# Altium schematic sheet 2 - Peripherals.SchDoc
size Tabloid
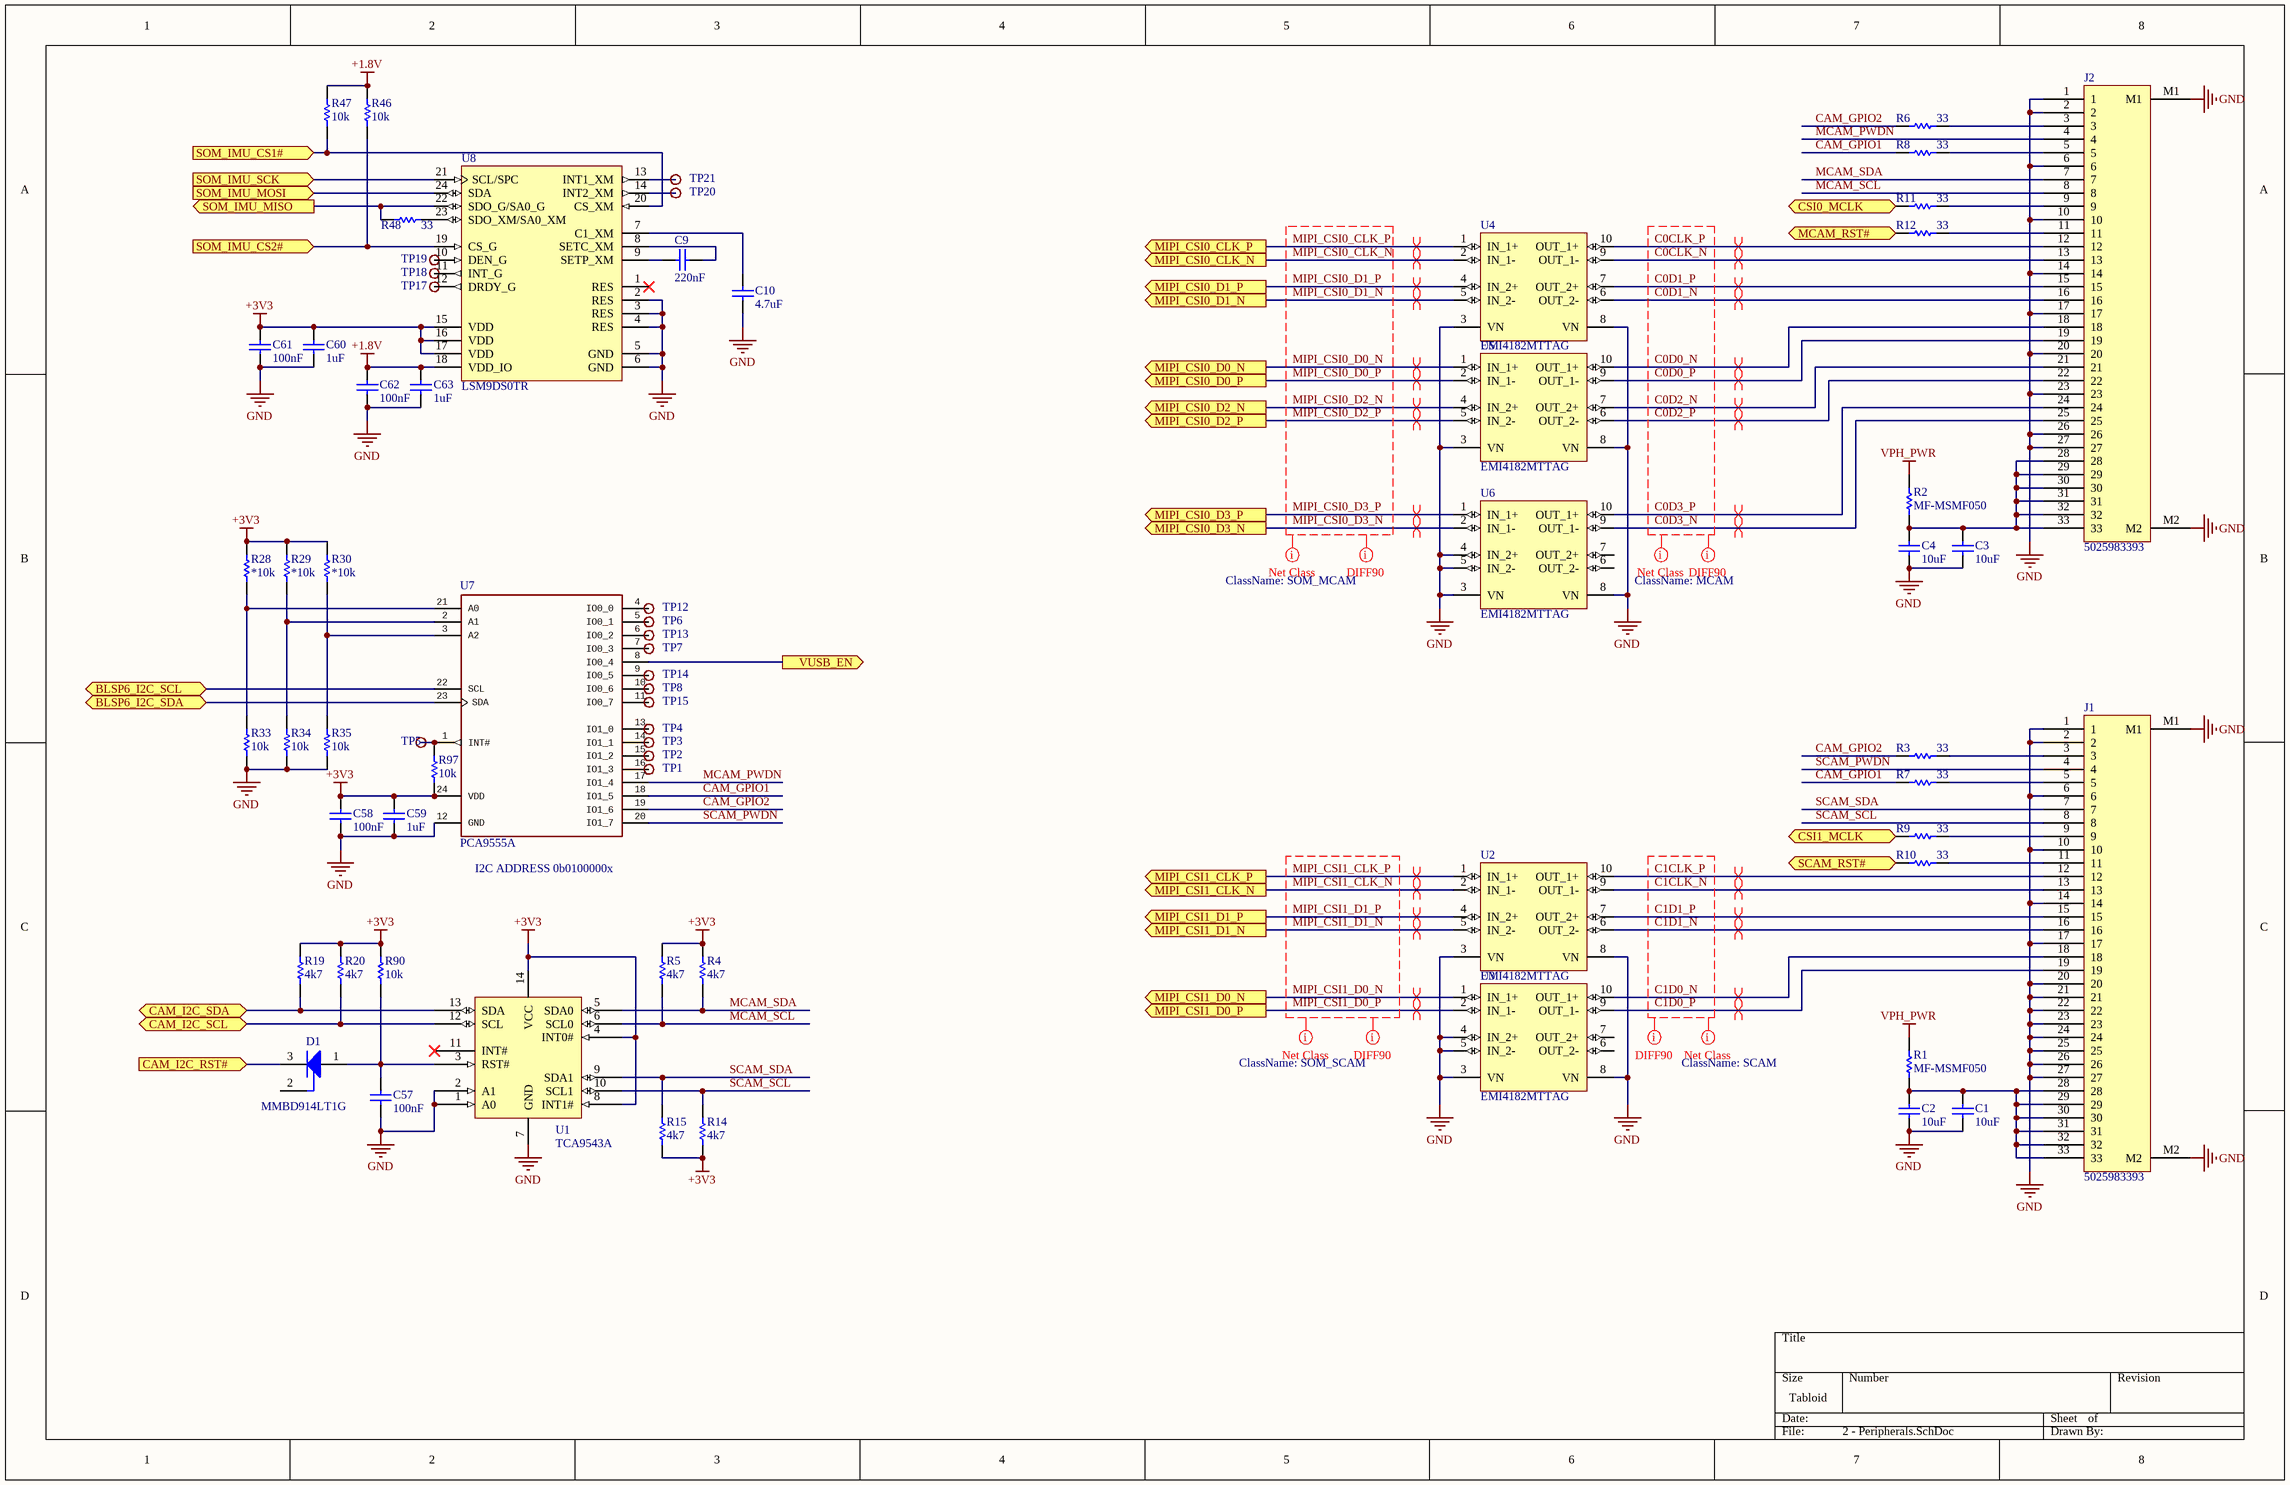
[diagram p0: 2 - Peripherals.SchDoc]

## Parts
C1  value 10uF  [CAPC0805(2012)100_L]  (hidden comment: CAP 10uF 6.3V 0805(2012))
C2  value 10uF  [CAPC0805(2012)100_L]  (hidden comment: CAP 10uF 6.3V 0805(2012))
C3  value 10uF  [CAPC0805(2012)100_L]  (hidden comment: CAP 10uF 6.3V 0805(2012))
C4  value 10uF  [CAPC0805(2012)100_L]  (hidden comment: CAP 10uF 6.3V 0805(2012))
C9  value 220nF  [CAPC0805(2012)100_L]
C10  value 4.7uF  [CAPC0805(2012)100_L]  (hidden comment: CAP 4.7uF 6.3V 0805(2012))
C57  value 100nF  [CAPC0805(2012)100_L]  (hidden comment: CAP 100nF 6.3V 0805(2012))
C58  value 100nF  [CAPC0805(2012)100_L]  (hidden comment: CAP 100nF 6.3V 0805(2012))
C59  value 1uF  [CAPC0805(2012)100_L]  (hidden comment: CAP 1uF 6.3V 0805(2012))
C60  value 1uF  [CAPC0805(2012)100_L]  (hidden comment: CAP 1uF 6.3V 0805(2012))
C61  value 100nF  [CAPC0805(2012)100_L]  (hidden comment: CAP 100nF 6.3V 0805(2012))
C62  value 100nF  [CAPC0805(2012)100_L]  (hidden comment: CAP 100nF 6.3V 0805(2012))
C63  value 1uF  [CAPC0805(2012)100_L]  (hidden comment: CAP 1uF 6.3V 0805(2012))
D1  MMBD914LT1G  [ONSC-SOT-23-3-318-08_V]
J1  5025983393  [J_MOLEX_50259833]
J2  5025983393  [J_MOLEX_50259833]
R1  MF-MSMF050  [BOUR-MF-MSMF050-2_V]
R2  MF-MSMF050  [BOUR-MF-MSMF050-2_V]
R3  value 33  [RESC0805(2012)_L]  (hidden comment: 33R 1% 0805(2012))
R4  value 4k7  [RESC0805(2012)_L]  (hidden comment: 4K7 1% 0805(2012))
R5  value 4k7  [RESC0805(2012)_L]  (hidden comment: 4K7 1% 0805(2012))
R6  value 33  [RESC0805(2012)_L]  (hidden comment: 33R 1% 0805(2012))
R7  value 33  [RESC0805(2012)_L]  (hidden comment: 33R 1% 0805(2012))
R8  value 33  [RESC0805(2012)_L]  (hidden comment: 33R 1% 0805(2012))
R9  value 33  [RESC0805(2012)_L]  (hidden comment: 33R 1% 0805(2012))
R10  value 33  [RESC0805(2012)_L]  (hidden comment: 33R 1% 0805(2012))
R11  value 33  [RESC0805(2012)_L]  (hidden comment: 33R 1% 0805(2012))
R12  value 33  [RESC0805(2012)_L]  (hidden comment: 33R 1% 0805(2012))
R14  value 4k7  [RESC0805(2012)_L]  (hidden comment: 4K7 1% 0805(2012))
R15  value 4k7  [RESC0805(2012)_L]  (hidden comment: 4K7 1% 0805(2012))
R19  value 4k7  [RESC0805(2012)_L]  (hidden comment: 4K7 1% 0805(2012))
R20  value 4k7  [RESC0805(2012)_L]  (hidden comment: 4K7 1% 0805(2012))
R28  value *10k  [RESC0805(2012)_L]  (hidden comment: 100k)
R29  value *10k  [RESC0805(2012)_L]  (hidden comment: 100k)
R30  value *10k  [RESC0805(2012)_L]  (hidden comment: 100k)
R33  value 10k  [RESC0805(2012)_L]  (hidden comment: 100k)
R34  value 10k  [RESC0805(2012)_L]  (hidden comment: 100k)
R35  value 10k  [RESC0805(2012)_L]  (hidden comment: 100k)
R46  value 10k  [RESC0805(2012)_L]  (hidden comment: 10K 1% 0805(2012))
R47  value 10k  [RESC0805(2012)_L]  (hidden comment: 10K 1% 0805(2012))
R48  value 33  [RESC0805(2012)_L]  (hidden comment: 33R 1% 0805(2012))
R90  value 10k  [RESC0805(2012)_L]  (hidden comment: 100k)
R97  10k  [RESC0805(2012)_L]
TP1  Various test points  [VIAHOLE20]  (value not drawn)
TP2  Various test points  [VIAHOLE20]  (value not drawn)
TP3  Various test points  [VIAHOLE20]  (value not drawn)
TP4  Various test points  [VIAHOLE20]  (value not drawn)
TP5  Various test points  [VIAHOLE20]  (value not drawn)
TP6  Various test points  [VIAHOLE20]  (value not drawn)
TP7  Various test points  [VIAHOLE20]  (value not drawn)
TP8  Various test points  [VIAHOLE20]  (value not drawn)
TP12  Various test points  [VIAHOLE20]  (value not drawn)
TP13  Various test points  [VIAHOLE20]  (value not drawn)
TP14  Various test points  [VIAHOLE20]  (value not drawn)
TP15  Various test points  [VIAHOLE20]  (value not drawn)
TP17  Various test points  [VIAHOLE20]  (value not drawn)
TP18  Various test points  [VIAHOLE20]  (value not drawn)
TP19  Various test points  [VIAHOLE20]  (value not drawn)
TP20  Various test points  [VIAHOLE20]  (value not drawn)
TP21  Various test points  [VIAHOLE20]  (value not drawn)
U1  TCA9543A  [SO14]
U2  EMI4182MTTAG  [ONSC-WDFN-10-511BM-01_V]
U3  EMI4182MTTAG  [ONSC-WDFN-10-511BM-01_V]
U4  EMI4182MTTAG  [ONSC-WDFN-10-511BM-01_V]
U5  EMI4182MTTAG  [ONSC-WDFN-10-511BM-01_V]
U6  EMI4182MTTAG  [ONSC-WDFN-10-511BM-01_V]
U7  PCA9555A  [SSOP24]
U8  LSM9DS0TR  [STM-LGA-24_V]

## Ports
BLSP6_I2C_SCL (bidir), BLSP6_I2C_SDA (bidir), CAM_I2C_RST# (in), CAM_I2C_SCL (bidir), CAM_I2C_SDA (bidir), CSI0_MCLK (in), CSI1_MCLK (in), MCAM_RST# (in), MIPI_CSI0_CLK_N (out), MIPI_CSI0_CLK_P (out), MIPI_CSI0_D0_N (out), MIPI_CSI0_D0_P (out), MIPI_CSI0_D1_N (out), MIPI_CSI0_D1_P (out), MIPI_CSI0_D2_N (out), MIPI_CSI0_D2_P (out), MIPI_CSI0_D3_N (out), MIPI_CSI0_D3_P (out), MIPI_CSI1_CLK_N (out), MIPI_CSI1_CLK_P (out), MIPI_CSI1_D0_N (out), MIPI_CSI1_D0_P (out), MIPI_CSI1_D1_N (out), MIPI_CSI1_D1_P (out), SCAM_RST# (in), SOM_IMU_CS1# (in), SOM_IMU_CS2# (in), SOM_IMU_MISO (out), SOM_IMU_MOSI (in), SOM_IMU_SCK (in), VUSB_EN (out)

## Nets
+1.8V: C62.1 C63.1 R46.1 R47.1 U8.18(VDD_IO)
+3V3: C58.1 C59.1 C60.1 C61.1 R4.2 R5.2 R14.1 R15.1 R19.2 R20.2 R28.2 R29.2 R30.2 R90.2 R97.1 U1.4(INT0#) U1.8(INT1#) U1.14(VCC) U7.24(VDD) U8.15(VDD) U8.16(VDD) U8.17(VDD)
GND: C1.1 C2.1 C3.1 C4.1 C10.1 C57.2 C58.2 C59.2 C60.2 C61.2 C62.2 C63.2 J1.1 J1.2 J1.6 J1.10 J1.14 J1.17 J1.20 J1.21 J1.22 J1.23 J1.24 J1.25 J1.26 J1.27 J1.M1 J1.M2 J2.1 J2.2 J2.6 J2.10 J2.14 J2.17 J2.20 J2.23 J2.26 J2.27 J2.M1 J2.M2 R33.1 R34.1 R35.1 U1.1(A0) U1.2(A1) U1.7(GND) U2.3(VN) U2.8(VN) U3.3(VN) U3.4(IN_2+) U3.5(IN_2-) U3.8(VN) U4.3(VN) U4.8(VN) U5.3(VN) U5.8(VN) U6.3(VN) U6.4(IN_2+) U6.5(IN_2-) U6.8(VN) U7.12(GND) U8.2(RES) U8.3(RES) U8.4(RES) U8.5(GND) U8.6(GND)
VPH_PWR: R1.2 R2.2
BLSP6_I2C_SCL: U7.22(SCL) ; port BLSP6_I2C_SCL
BLSP6_I2C_SDA: U7.23(SDA) ; port BLSP6_I2C_SDA
C0CLK_N: J2.13 U4.9(OUT_1-)
C0CLK_P: J2.12 U4.10(OUT_1+)
C0D0_N: J2.18 U5.10(OUT_1+)
C0D0_P: J2.19 U5.9(OUT_1-)
C0D1_N: J2.16 U4.6(OUT_2-)
C0D1_P: J2.15 U4.7(OUT_2+)
C0D2_N: J2.21 U5.7(OUT_2+)
C0D2_P: J2.22 U5.6(OUT_2-)
C0D3_N: J2.25 U6.9(OUT_1-)
C0D3_P: J2.24 U6.10(OUT_1+)
C1CLK_N: J1.13 U2.9(OUT_1-)
C1CLK_P: J1.12 U2.10(OUT_1+)
C1D0_N: J1.18 U3.10(OUT_1+)
C1D0_P: J1.19 U3.9(OUT_1-)
C1D1_N: J1.16 U2.6(OUT_2-)
C1D1_P: J1.15 U2.7(OUT_2+)
CAM_GPIO1: R7.1 R8.1 U7.18(IO1_5)
CAM_GPIO2: R3.1 R6.1 U7.19(IO1_6)
CAM_I2C_RST#: D1.3(K) ; port CAM_I2C_RST#
CAM_I2C_SCL: R20.1 U1.12(SCL) ; port CAM_I2C_SCL
CAM_I2C_SDA: R19.1 U1.13(SDA) ; port CAM_I2C_SDA
CSI0_MCLK: R11.1 ; port CSI0_MCLK
CSI1_MCLK: R9.1 ; port CSI1_MCLK
MCAM_PWDN: J2.4 U7.17(IO1_4)
MCAM_RST#: R12.1 ; port MCAM_RST#
MCAM_SCL: J2.8 R5.1 U1.6(SCL0)
MCAM_SDA: J2.7 R4.1 U1.5(SDA0)
MIPI_CSI0_CLK_N: U4.2(IN_1-) ; port MIPI_CSI0_CLK_N
MIPI_CSI0_CLK_P: U4.1(IN_1+) ; port MIPI_CSI0_CLK_P
MIPI_CSI0_D0_N: U5.1(IN_1+) ; port MIPI_CSI0_D0_N
MIPI_CSI0_D0_P: U5.2(IN_1-) ; port MIPI_CSI0_D0_P
MIPI_CSI0_D1_N: U4.5(IN_2-) ; port MIPI_CSI0_D1_N
MIPI_CSI0_D1_P: U4.4(IN_2+) ; port MIPI_CSI0_D1_P
MIPI_CSI0_D2_N: U5.4(IN_2+) ; port MIPI_CSI0_D2_N
MIPI_CSI0_D2_P: U5.5(IN_2-) ; port MIPI_CSI0_D2_P
MIPI_CSI0_D3_N: U6.2(IN_1-) ; port MIPI_CSI0_D3_N
MIPI_CSI0_D3_P: U6.1(IN_1+) ; port MIPI_CSI0_D3_P
MIPI_CSI1_CLK_N: U2.2(IN_1-) ; port MIPI_CSI1_CLK_N
MIPI_CSI1_CLK_P: U2.1(IN_1+) ; port MIPI_CSI1_CLK_P
MIPI_CSI1_D0_N: U3.1(IN_1+) ; port MIPI_CSI1_D0_N
MIPI_CSI1_D0_P: U3.2(IN_1-) ; port MIPI_CSI1_D0_P
MIPI_CSI1_D1_N: U2.5(IN_2-) ; port MIPI_CSI1_D1_N
MIPI_CSI1_D1_P: U2.4(IN_2+) ; port MIPI_CSI1_D1_P
SCAM_PWDN: J1.4 U7.20(IO1_7)
SCAM_RST#: R10.1 ; port SCAM_RST#
SCAM_SCL: J1.8 R14.2 U1.10(SCL1)
SCAM_SDA: J1.7 R15.2 U1.9(SDA1)
SOM_IMU_CS1#: R47.2 U8.20(CS_XM) ; port SOM_IMU_CS1#
SOM_IMU_CS2#: R46.2 U8.19(CS_G) ; port SOM_IMU_CS2#
SOM_IMU_MISO: R48.1 U8.22(SDO_G/SA0_G) ; port SOM_IMU_MISO
SOM_IMU_MOSI: U8.24(SDA) ; port SOM_IMU_MOSI
SOM_IMU_SCK: U8.21(SCL/SPC) ; port SOM_IMU_SCK
VUSB_EN: U7.8(IO0_4) ; port VUSB_EN
NetC1_2: C1.2 C2.2 J1.28 J1.29 J1.30 J1.31 J1.32 J1.33 R1.1
NetC3_2: C3.2 C4.2 J2.28 J2.29 J2.30 J2.31 J2.32 J2.33 R2.1
NetC9_1: C9.1 U8.9(SETP_XM)
NetC9_2: C9.2 U8.8(SETC_XM)
NetC10_2: C10.2 U8.7(C1_XM)
NetC57_1: C57.1 D1.1(A) R90.1 U1.3(RST#)
NetJ1_3: J1.3 R3.2
NetJ1_5: J1.5 R7.2
NetJ1_9: J1.9 R9.2
NetJ1_11: J1.11 R10.2
NetJ2_3: J2.3 R6.2
NetJ2_5: J2.5 R8.2
NetJ2_9: J2.9 R11.2
NetJ2_11: J2.11 R12.2
NetR28_1: R28.1 R33.2 U7.21(A0)
NetR29_1: R29.1 R34.2 U7.2(A1)
NetR30_1: R30.1 R35.2 U7.3(A2)
NetR48_2: R48.2 U8.23(SDO_XM/SA0_XM)
NetR97_2: R97.2 TP5.1 U7.1(INT#)
NetTP1_1: TP1.1 U7.16(IO1_3)
NetTP2_1: TP2.1 U7.15(IO1_2)
NetTP3_1: TP3.1 U7.14(IO1_1)
NetTP4_1: TP4.1 U7.13(IO1_0)
NetTP6_1: TP6.1 U7.5(IO0_1)
NetTP7_1: TP7.1 U7.7(IO0_3)
NetTP8_1: TP8.1 U7.10(IO0_6)
NetTP12_1: TP12.1 U7.4(IO0_0)
NetTP13_1: TP13.1 U7.6(IO0_2)
NetTP14_1: TP14.1 U7.9(IO0_5)
NetTP15_1: TP15.1 U7.11(IO0_7)
NetTP17_1: TP17.1 U8.12(DRDY_G)
NetTP18_1: TP18.1 U8.11(INT_G)
NetTP19_1: TP19.1 U8.10(DEN_G)
NetTP20_1: TP20.1 U8.14(INT2_XM)
NetTP21_1: TP21.1 U8.13(INT1_XM)

Not connected (* = marked no-connect by the designer): D1 2(NC); U1 11(INT#)*; U3 6(OUT_2-) 7(OUT_2+); U6 6(OUT_2-) 7(OUT_2+); U8 1(RES)*

## Layout directives
differential pair: C0CLK_N, C0CLK_P, C0D0_N, C0D0_P, C0D1_N, C0D1_P, C0D2_N, C0D2_P, C0D3_N, C0D3_P, C1CLK_N, C1CLK_P, C1D0_N, C1D0_P, C1D1_N, C1D1_P, MIPI_CSI0_CLK_N, MIPI_CSI0_CLK_P, MIPI_CSI0_D0_N, MIPI_CSI0_D0_P, MIPI_CSI0_D1_N, MIPI_CSI0_D1_P, MIPI_CSI0_D2_N, MIPI_CSI0_D2_P, MIPI_CSI0_D3_N, MIPI_CSI0_D3_P, MIPI_CSI1_CLK_N, MIPI_CSI1_CLK_P, MIPI_CSI1_D0_N, MIPI_CSI1_D0_P, MIPI_CSI1_D1_N, MIPI_CSI1_D1_P
net class SOM_MCAM: MIPI_CSI0_CLK_N, MIPI_CSI0_CLK_P, MIPI_CSI0_D0_N, MIPI_CSI0_D0_P, MIPI_CSI0_D1_N, MIPI_CSI0_D1_P, MIPI_CSI0_D2_N, MIPI_CSI0_D2_P, MIPI_CSI0_D3_N, MIPI_CSI0_D3_P
net class SOM_SCAM: MIPI_CSI1_CLK_N, MIPI_CSI1_CLK_P, MIPI_CSI1_D0_N, MIPI_CSI1_D0_P, MIPI_CSI1_D1_N, MIPI_CSI1_D1_P
net class SCAM: C1CLK_N, C1CLK_P, C1D0_N, C1D0_P, C1D1_N, C1D1_P
net class MCAM: C0CLK_N, C0CLK_P, C0D0_N, C0D0_P, C0D1_N, C0D1_P, C0D2_N, C0D2_P, C0D3_N, C0D3_P
net class DIFF90: C0CLK_N, C0CLK_P, C0D0_N, C0D0_P, C0D1_N, C0D1_P, C0D2_N, C0D2_P, C0D3_N, C0D3_P, C1CLK_N, C1CLK_P, C1D0_N, C1D0_P, C1D1_N, C1D1_P, MIPI_CSI0_CLK_N, MIPI_CSI0_CLK_P, MIPI_CSI0_D0_N, MIPI_CSI0_D0_P, MIPI_CSI0_D1_N, MIPI_CSI0_D1_P, MIPI_CSI0_D2_N, MIPI_CSI0_D2_P, MIPI_CSI0_D3_N, MIPI_CSI0_D3_P, MIPI_CSI1_CLK_N, MIPI_CSI1_CLK_P, MIPI_CSI1_D0_N, MIPI_CSI1_D0_P, MIPI_CSI1_D1_N, MIPI_CSI1_D1_P

## Notes on the sheet
- (near U7) I2C ADDRESS 0b0100000x

## Library data of the parts
C1-C4 = CMP-1036-04917-1: CAP 10uF 6.3V Â±10% 0805 (2012 Metric) Thickness 1mm SMD; Case-EIA: 0805; Case-Metric: 2012; Max Thickness: 1 mm; Tolerance: Â±10%; Technology: SMT; Rated Voltage: 6.3 V
C9 = CMP-1036-04520-1: CAP 220nF 6.3V Â±20% 0805 (2012 Metric) Thickness 1mm SMD; Case-Metric: 2012; Case-EIA: 0805; Technology: SMT; Tolerance: Â±20%; Max Thickness: 1 mm; Rated Voltage: 6.3 V
C10 = CMP-1036-04879-1: CAP 4.7uF 6.3V Â±20% 0805 (2012 Metric) Thickness 1mm SMD; Case-Metric: 2012; Case-EIA: 0805; Max Thickness: 1 mm; Technology: SMT; Tolerance: Â±20%; Rated Voltage: 6.3 V
C57 C58 C61 C62 = CMP-1036-04391-1: CAP 100nF 6.3V Â±10% 0805 (2012 Metric) Thickness 1mm SMD; Case-EIA: 0805; Case-Metric: 2012; Rated Voltage: 6.3 V; Technology: SMT; Tolerance: Â±10%; Max Thickness: 1 mm
C59 C60 C63 = CMP-1036-04730-1: CAP 1uF 6.3V Â±5% 0805 (2012 Metric) Thickness 1mm SMD; Case-Metric: 2012; Case-EIA: 0805; Technology: SMT; Tolerance: Â±5%; Max Thickness: 1 mm; Rated Voltage: 6.3 V
D1 = CMP-1054-00123-1: High-Speed Switching Diode, 3-Pin SOT-23, Pb-Free, Tape and Reel; Manufacturer: On Semiconductor; IF Max (A): 0.2; Configuration: Single; trr Max (ns): 4; PackageVersion: Rev. AP, 11/2009; ComponentLink2Description: Datasheet; ComponentLink1URL: http://www.onsemi.com/; DatasheetVersion: Rev. 7; RoHS: TRUE; ComponentLink2URL: http://www.onsemi.cn/pub_link/Collateral/MMBD914LT1-D.PDF; PackageReference: SOT-23-3-318-08; ComponentLink1Description: Manufacturer URL; Packing: Tape and Reel; PartNumber: MMBD914LT1G; PackageDescription: 3-Pin Small Outline Transistor, Body 2.92 x 1.3 mm, Pitch 0.95 mm; Mounting Technology: Surface Mount; ComponentLink3Description: Package Specification; ComponentLink3URL: http://www.onsemi.cn/pub_link/Collateral/318-08.PDF
R1 R2 = CMP-0280-00002-2: MF-MSMF Series - PTC Resettable Fuse, 15 V Max, 0.15 Ohm Min, -40 to 85 degC, RoHS, Reel; Manufacturer: Bourns; Voltage DC (Max): 15 V; Trip Current: 1 A; Hold Current: 0.5 A; Current Rating (Max): 100 A; ComponentLink1Description: Manufacturer URL; Operating Temperature Range: -40 to 85 degC; ComponentLink2URL: http://www.bourns.com/data/global/pdfs/mfmsmf.pdf; PackageReference: MF-MSMF050; ComponentLink2Description: Datasheet; PartNumber: MF-MSMF050; DatasheetVersion: Rev. AD; ComponentLink3URL: http://www.bourns.com/data/global/pdfs/mfmsmf.pdf; ComponentLink3Description: Package Specification; RoHS: TRUE; PackageDescription: 2-Pin SMD, Body 4.55 x 3.24 mm; Mounting Technology: Surface Mount; Packing: Reel; Resistance (Min): 0.15 Ohm; ComponentLink1URL: http://www.bourns.com/
R3 R6-R12 R48 = CMP-1013-00341-1: 33R 0.125W 1% 0805 (2012 Metric)  SMD; Case-EIA: 0805; Case-Metric: 2012; Technology: SMT; Power: 0.125 W; Tolerance: 1 %
R4 R5 R14 R15 R19 R20 = CMP-1013-00586-1: 4K7 0.125W 1% 0805 (2012 Metric)  SMD; Case-Metric: 2012; Case-EIA: 0805; Technology: SMT; Power: 0.125 W; Tolerance: 1 %
R28-R30 R33-R35 R46 R47 R90 = CMP-1013-00623-1: 10K 0.125W 1% 0805 (2012 Metric)  SMD; Case-Metric: 2012; Case-EIA: 0805; Tolerance: 1 %; Power: 0.125 W; Technology: SMT
R97 = CMP-1013-00623-1: Case-Metric: 2012; Case-EIA: 0805; Tolerance: 1 %; Power: 0.125 W; Value: 10k; Technology: SMT
TP1-TP8 TP12-TP15 TP17-TP21 = TESTPOINTHOLE035
U1 = TCA9543A: Low Voltage 2-Channel I2C Bus Switch with Interrupt and Reset
U2-U6 = CMP-1066-00059-1: Common Mode Filter with ESD Protection, -40 to 85 degC, 10-Pin WDFN, Pb-Free, Tape and Reel; Manufacturer: On Semiconductor; C Typ (pF): 0.8; VRWM Max (V): 5; Number of Lines: 4; PackageDescription: 10-Pin Small Outline No-Lead, Body 2.5 x 2 mm, Pitch 0.5 mm; ComponentLink1URL: http://www.onsemi.com/; ComponentLink2Description: Datasheet; ComponentLink3Description: Package Specification; ComponentLink2URL: http://www.onsemi.cn/pub_link/Collateral/EMI4182-D.PDF; ComponentLink1Description: Manufacturer URL; PackageVersion: Rev. O, 06/2010; Packing: Tape and Reel; RoHS: Pb-Free; Mounting Technology: Surface Mount; ComponentLink3URL: http://www.onsemi.cn/pub_link/Collateral/511BM.PDF; DatasheetVersion: Rev. 1; PackageReference: WDFN-10-511BM-01; PartNumber: EMI4182MTTAG
U7 = PCA9555SSOP24
U8 = CMP-1273-00002-1: INEMO Inertial Module: 3D Accelerometer, 3D Gyroscope, 3D Magnetometer, 2.4 to 3.6 V, -40 to 85 degC, 24-Pin LGA, RoHS, Tape and Reel; Manufacturer: STMicroelectronics; VDDIO: 1.71 V Min.; IDD_XM: 350 uA Typ.; IDD_G_LP: 2 mA Typ.; IDD_G: 6.1 mA Typ.; IDD_PDN: 6 uA Typ.; Bandwidth: 400 kHz; DatasheetVersion: Rev. 2; PartNumber: LSM9DS0TR; ComponentLink2URL: http://www.st.com/st-web-ui/static/active/en/resource/technical/document/datasheet/DM00087365.pdf; ComponentLink3Description: Package Specification; Packing: Tape and Reel; ComponentLink3URL: http://www.st.com/st-web-ui/static/active/en/resource/technical/document/datasheet/DM00087365.pdf; Mounting Technology: Surface Mount; ComponentLink1Description: Manufacturer URL; RoHS: TRUE; Operating Temperature Range: -40 to 85 degC; VDD: 2.4 to 3.6 V; ComponentLink1URL: http://www.st.com/; PackageDescription: 24-Pin Land Grid Array, Body 4 x 4 mm, Pitch 0.5 mm; ComponentLink2Description: Datasheet